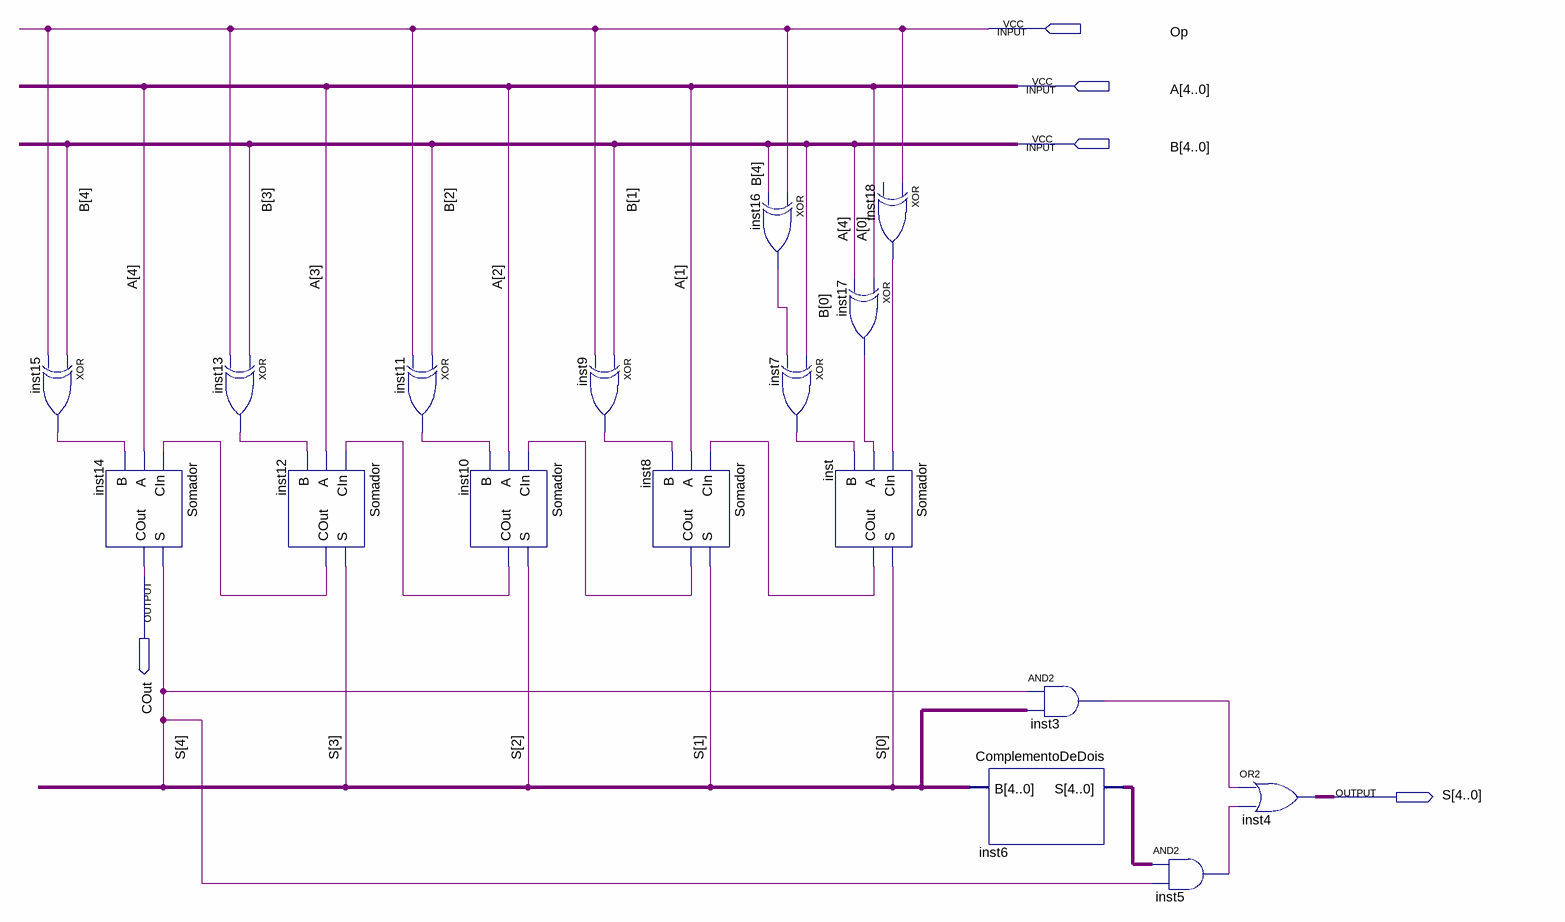
[diagram p0: schematic sheet]
// Quartus schematic teste.bdf as structural Verilog: 17 symbols, 5 pins
module teste (
  input  Op,
  input  [4:0] A,
  input  [4:0] B,
  output COut,
  output [4:0] S
);

  wire inst3_out, inst5_out, inst7_out, inst8_cout, inst9_out, inst10_cout, inst11_out, inst12_cout,
       inst13_out, inst15_out, inst16_out, inst17_out, inst18_out, inst_cout;
  wire [4:0] inst6_s, undriven;

  xor inst15 (inst15_out, B[4], Op);
  Somador inst14 (.CIn(inst12_cout), .A(A[4]), .B(inst15_out), .S(S[4]), .COut(COut));
  xor inst13 (inst13_out, B[3], Op);
  Somador inst12 (.CIn(inst10_cout), .A(A[3]), .B(inst13_out), .S(S[3]), .COut(inst12_cout));
  xor inst11 (inst11_out, B[2], Op);
  Somador inst10 (.CIn(inst8_cout), .A(A[2]), .B(inst11_out), .S(S[2]), .COut(inst10_cout));
  xor inst9 (inst9_out, B[1], Op);
  Somador inst8 (.CIn(inst_cout), .A(A[1]), .B(inst9_out), .S(S[1]), .COut(inst8_cout));
  xor inst16 (inst16_out, Op, B[4]);
  xor inst7 (inst7_out, B[0], inst16_out);
  xor inst17 (inst17_out, A[0], A[4]);
  Somador inst (.CIn(inst18_out), .A(inst17_out), .B(inst7_out), .S(S[0]), .COut(inst_cout));
  buf inst18 (inst18_out, Op);  // XOR open: IN2
  ComplementoDeDois inst6 (.B(undriven), .S(inst6_s));
  assign inst3_out = {5{S[4]}} & undriven;  // AND2 inst3, 5 bits wide
  assign inst5_out = inst6_s & {5{S[4]}};  // AND2 inst5, 5 bits wide
  assign S = {5{inst3_out}} | {5{inst5_out}};  // OR2 inst4, 5 bits wide
endmodule
